# Altium schematic sheet digital_IO.SchDoc: Control Plane
size Letter; Author: Ye-Sheng Kuo; Revision: 2; SheetNumber: 4; SheetTotal: 8
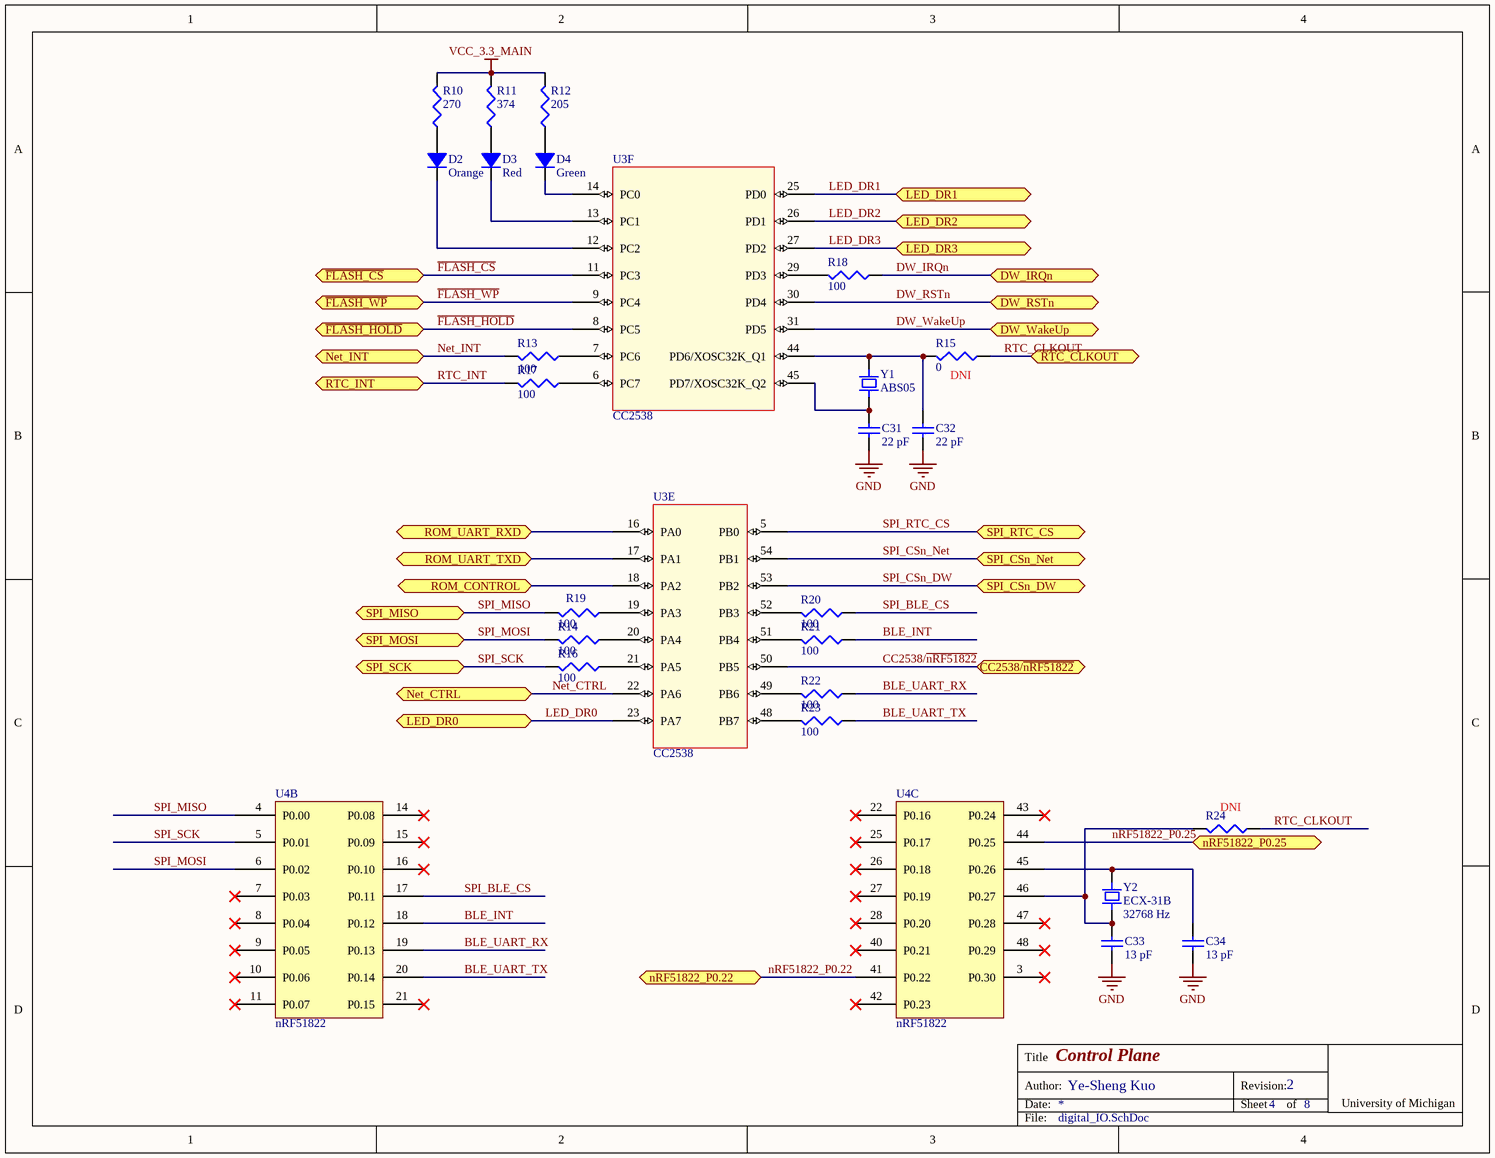
[diagram p0: digital_IO.SchDoc]

## Parts
C31  value 22 pF  [0402]  (hidden comment: Ceramic capacitor)
C32  value 22 pF  [0402]  (hidden comment: Ceramic capacitor)
C33  value 13 pF  [0402]  (hidden comment: Ceramic capacitor)
C34  value 13 pF  [0402]  (hidden comment: Ceramic capacitor)
D2  Color: Orange  [0402 - DIODE]  (hidden comment: LED, Orange)
D3  Color: Red  [0402 - DIODE]  (hidden comment: LED, Red)
D4  Color: Green  [0402 - DIODE]  (hidden comment: LED, Green)
R10  value 270  [0402]  (hidden comment: Chip resistor)
R11  value 374  [0402]  (hidden comment: Chip resistor)
R12  value 205  [0402]  (hidden comment: Chip resistor)
R13  value 100  [0402]  (hidden comment: Chip resistor)
R14  value 100  [0402]  (hidden comment: Chip resistor)
R15  value 0  [0402]  (hidden comment: Chip resistor)
R16  value 100  [0402]  (hidden comment: Chip resistor)
R17  value 100  [0402]  (hidden comment: Chip resistor)
R18  value 100  [0402]  (hidden comment: Chip resistor)
R19  value 100  [0402]  (hidden comment: Chip resistor)
R20  value 100  [0402]  (hidden comment: Chip resistor)
R21  value 100  [0402]  (hidden comment: Chip resistor)
R22  value 100  [0402]  (hidden comment: Chip resistor)
R23  value 100  [0402]  (hidden comment: Chip resistor)
R24  value 0  [0402]  (hidden comment: Chip resistor)
U3  CC2538  [QFN56]  (parts E,F of 6)
U4  nRF51822  [QFN-48]  (parts B,C of 5)
Y1  ABS05  [ABS05]
Y2  ECX-31B  Frequency: 32768 Hz  [ECX-31B]

## Ports
CC2538/~{nRF51822}, DW_IRQn, DW_RSTn, DW_WakeUp, LED_DR0, LED_DR1, LED_DR2, LED_DR3, Net_CTRL, Net_INT, nRF51822_P0.22, nRF51822_P0.25, ROM_CONTROL, ROM_UART_RXD, ROM_UART_TXD, RTC_CLKOUT, RTC_INT, SPI_CSn_DW, SPI_CSn_Net, SPI_MISO, SPI_MOSI, SPI_RTC_CS, SPI_SCK, ~{FLASH_CS}, ~{FLASH_HOLD}, ~{FLASH_WP}

## Nets
GND: C31.2 C32.2 C33.2 C34.2
VCC_3.3_MAIN: R10.1 R11.1 R12.1
BLE_INT: R21.2 U4.18(P0.12)
BLE_UART_RX: R22.2 U4.19(P0.13)
BLE_UART_TX: R23.2 U4.20(P0.14)
CC2538/~{nRF51822}: U3.50(PB5) ; port CC2538/~{nRF51822}
DW_IRQn: R18.2 ; port DW_IRQn
DW_RSTn: U3.30(PD4) ; port DW_RSTn
DW_WakeUp: U3.31(PD5) ; port DW_WakeUp
~{FLASH_CS}: U3.11(PC3) ; port ~{FLASH_CS}
~{FLASH_HOLD}: U3.8(PC5) ; port ~{FLASH_HOLD}
~{FLASH_WP}: U3.9(PC4) ; port ~{FLASH_WP}
LED_DR0: U3.23(PA7) ; port LED_DR0
LED_DR1: U3.25(PD0) ; port LED_DR1
LED_DR2: U3.26(PD1) ; port LED_DR2
LED_DR3: U3.27(PD2) ; port LED_DR3
Net_CTRL: U3.22(PA6) ; port Net_CTRL
Net_INT: R13.1 ; port Net_INT
nRF51822_P0.22: U4.41(P0.22) ; port nRF51822_P0.22
nRF51822_P0.25: U4.44(P0.25) ; port nRF51822_P0.25
ROM_CONTROL: U3.18(PA2) ; port ROM_CONTROL
ROM_UART_RXD: U3.16(PA0) ; port ROM_UART_RXD
ROM_UART_TXD: U3.17(PA1) ; port ROM_UART_TXD
RTC_CLKOUT: R15.2 R24.2 ; port RTC_CLKOUT
RTC_INT: R17.1 ; port RTC_INT
SPI_BLE_CS: R20.2 U4.17(P0.11)
SPI_CSn_DW: U3.53(PB2) ; port SPI_CSn_DW
SPI_CSn_Net: U3.54(PB1) ; port SPI_CSn_Net
SPI_MISO: R19.1 U4.4(P0.00) ; port SPI_MISO
SPI_MOSI: R14.1 U4.6(P0.02) ; port SPI_MOSI
SPI_RTC_CS: U3.5(PB0) ; port SPI_RTC_CS
SPI_SCK: R16.1 U4.5(P0.01) ; port SPI_SCK
NetC31_1: C31.1 U3.45(PD7/XOSC32K_Q2) Y1.2
NetC32_1: C32.1 R15.1 U3.44(PD6/XOSC32K_Q1) Y1.1
NetC33_1: C33.1 R24.1 U4.46(P0.27) Y2.2
NetC34_1: C34.1 U4.45(P0.26) Y2.1
NetD2_1: D2.1 R10.2
NetD2_2: D2.2 U3.12(PC2)
NetD3_1: D3.1 R11.2
NetD3_2: D3.2 U3.13(PC1)
NetD4_1: D4.1 R12.2
NetD4_2: D4.2 U3.14(PC0)
NetR13_2: R13.2 U3.7(PC6)
NetR14_2: R14.2 U3.20(PA4)
NetR16_2: R16.2 U3.21(PA5)
NetR17_2: R17.2 U3.6(PC7)
NetR18_1: R18.1 U3.29(PD3)
NetR19_2: R19.2 U3.19(PA3)
NetR20_1: R20.1 U3.52(PB3)
NetR21_1: R21.1 U3.51(PB4)
NetR22_1: R22.1 U3.49(PB6)
NetR23_1: R23.1 U3.48(PB7)

Not connected (* = marked no-connect by the designer): U4 3(P0.30)* 7(P0.03)* 8(P0.04)* 9(P0.05)* 10(P0.06)* 11(P0.07)* 14(P0.08)* 15(P0.09)* 16(P0.10)* 21(P0.15)* 22(P0.16)* 25(P0.17)* 26(P0.18)* 27(P0.19)* 28(P0.20)* 40(P0.21)* 42(P0.23)* 43(P0.24)* 47(P0.28)* 48(P0.29)*

## Notes on the sheet
- (near R15) DNI
- (near R24) DNI
- Title
- Date:
- Author:
- Revision:
- Sheet
- of
- University of Michigan
- File:

## Library data of the parts
C31 C32 = C_22p_0402_ceramic: Ceramic capacitor, 22 pF, 0402 package; Manufacture: Johanson; voltage rated: 50 V; tolerance: 2%; package: 0402; Supplier 1: Digi-Key; Supplier Part Number 1: 712-1274-1-ND
C33 C34 = C_13p_0402_50V_ceramic: Ceramic capacitor, 13 pF, 50 V, 0402 package; Manufacture: Murata; voltage rated: 50 V; tolerance: 5%; package: 0402; Supplier 1: Digi-Key; Supplier Part Number 1: 490-5925-1-ND
D2 = D_LED_ORANGE_0402: LED, Orange, 0402; Supplier 1: Digi-Key; Supplier Part Number 1: 511-1590-1-ND; package: 0402
D3 = D_LED_RED_0402: LED, Red, 0402; package: 0402; Supplier 1: Digi-Key; Supplier Part Number 1: 511-1593-1-ND
D4 = D_LED_GREEN_0402: LED, Green,  0402; package: 0402; Supplier 1: Digi-Key; Supplier Part Number 1: 511-1592-1-ND
R10 = R_270_0402: Chip resistor, 270, 0402 package; tolerance: 1%; power: 1/16 W; package: 0402; Supplier 1: Digi-Key; Supplier Part Number 1: 541-270LCT-ND
R11 = R_374_0402: Chip resistor, 374, 0402 package; tolerance: 1%; power: 1/16 W; package: 0402; Supplier 1: Digi-Key; Supplier Part Number 1: 541-374LCT-ND
R12 = R_205_0402: Chip resistor, 205, 0402 package; tolerance: 1%; power: 1/16 W; package: 0402; Supplier 1: Digi-Key; Supplier Part Number 1: 541-205LCT-ND
R13 R14 R16-R23 = R_100_0402: Chip resistor, 100, 0402 package; tolerance: 1%; power: 1/16 W; package: 0402; Supplier 1: Digi-Key; Supplier Part Number 1: 541-100LCT-ND
R15 R24 = R_0_0402: Chip resistor, 0, 0402 package; package: 0402; Supplier 1: Digi-Key; Supplier Part Number 1: 541-0.0YBCT-ND
U3 = CC2538: A Powerful System-On-Chip for 2.4-GHz IEEE 802.15.4, 6LoWPAN  and ZigBee Applications; Supplier 1: Digi-Key; Supplier Part Number 1: 296-35797-1-ND
U4 = nRF51822: Multiprotocol Bluetooth® low energy/2.4 GHz RF System on Chip; Supplier 1: Digi-Key; Supplier Part Number 1: 1490-1032-1-ND
Y1 = ABS05: 32768 Hz SMD Low profile crystal; Supplier 1: Digi-Key; Supplier Part Number 1: 535-11899-1-ND
Y2 = ECX-31B: SMD TUNING FORK CRYSTAL; Load capacitance: 9 pF; ESR: 70 Kohm; Shunt capacitance: 1.05 pF; Frequency tolerance: 20 ppm; Supplier 1: Digi-Key; Supplier Part Number 1: XC1950CT-ND